# Altium schematic sheet DriverControls_PeriphealBlockDiagram.SchDoc: Block Diagram
size Letter; Revision: 1.23; SheetNumber: 1; SheetTotal: 2
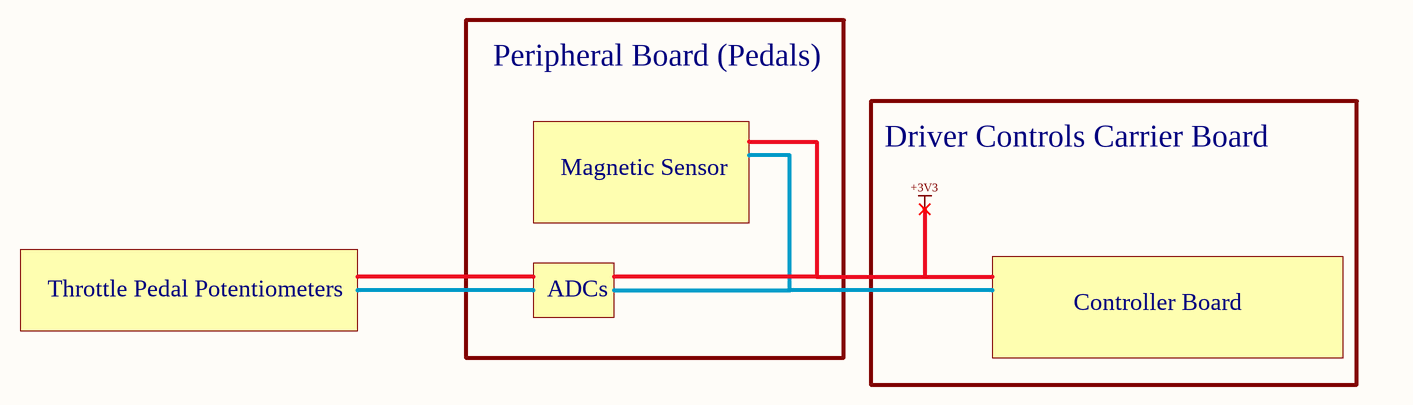
[diagram p0: DriverControls_PeriphealBlockDiagram.SchDoc]

## Notes on the sheet
- Peripheral Board (Pedals)
- Magnetic Sensor
- Driver Controls Carrier Board
- Throttle Pedal Potentiometers
- ADCs
- Controller Board
- Labels drawn without touching a wire or pin: +3V3
- Project:
- Title:
- Size:
- Project Lead:
- Letter
- Revision:
- University of Waterloo
- 200 University Ave W
- Waterloo, ON, Canada
- N2L 3E9
- Date:
- Sheet
- of
- Website: